# Altium schematic sheet mechanical.SchDoc: Mechanical Elements
size A4; SheetNumber: 17; SheetTotal: 21
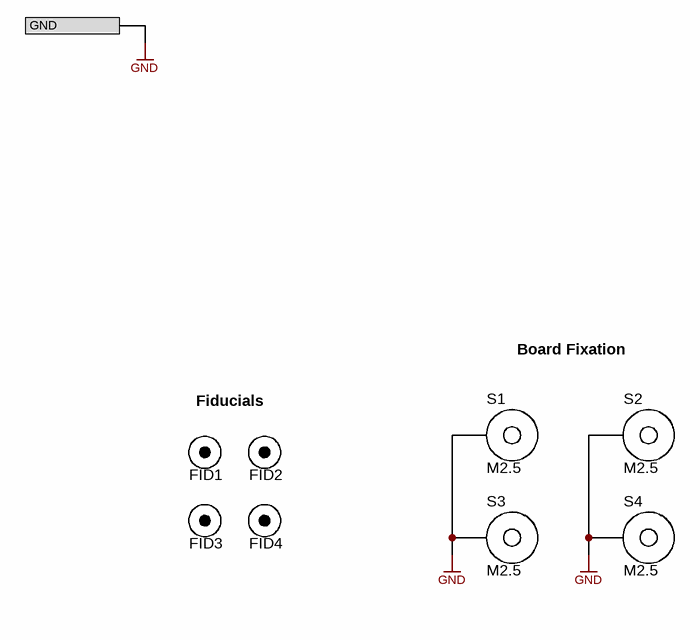
[diagram p0: mechanical.SchDoc]

## Parts
FID1  Fiducial 1.5 mm  [FIDUCIAL]  (value not drawn)  (no BOM)
FID2  Fiducial 1.5 mm  [FIDUCIAL]  (value not drawn)  (no BOM)
FID3  Fiducial 1.5 mm  [FIDUCIAL]  (value not drawn)  (no BOM)
FID4  Fiducial 1.5 mm  [FIDUCIAL]  (value not drawn)  (no BOM)
S1  M2.5  [HW/HOLE/M2.5/VIA]  (no BOM)
S2  M2.5  [HW/HOLE/M2.5/VIA]  (no BOM)
S3  M2.5  [HW/HOLE/M2.5/VIA]  (no BOM)
S4  M2.5  [HW/HOLE/M2.5/VIA]  (no BOM)

## Ports
GND

## Nets
GND: S1.1 S2.1 S3.1 S4.1 ; port GND

## Notes on the sheet
- Fiducials
- Board Fixation
- HES-SO / HEIG-VD / TIN / IAI
  Route de Cheseaux, 1
  CH-1401 Yverdon-les-Bains
  +41 24 557 73 77
  http://iai.heig-vd.ch
  iai@heig-vd.ch
- Title
- Format
- Date
- A4
- Project Name
- Author
- Project ID
- VCS
- Revision
- Page
- /
- File

## Library data of the parts
FID1-FID4 = FIDUCIAL
S1-S4 = HOLE/M2.5